# EAGLE design BUZZI-07 (EAGLE 4.15)
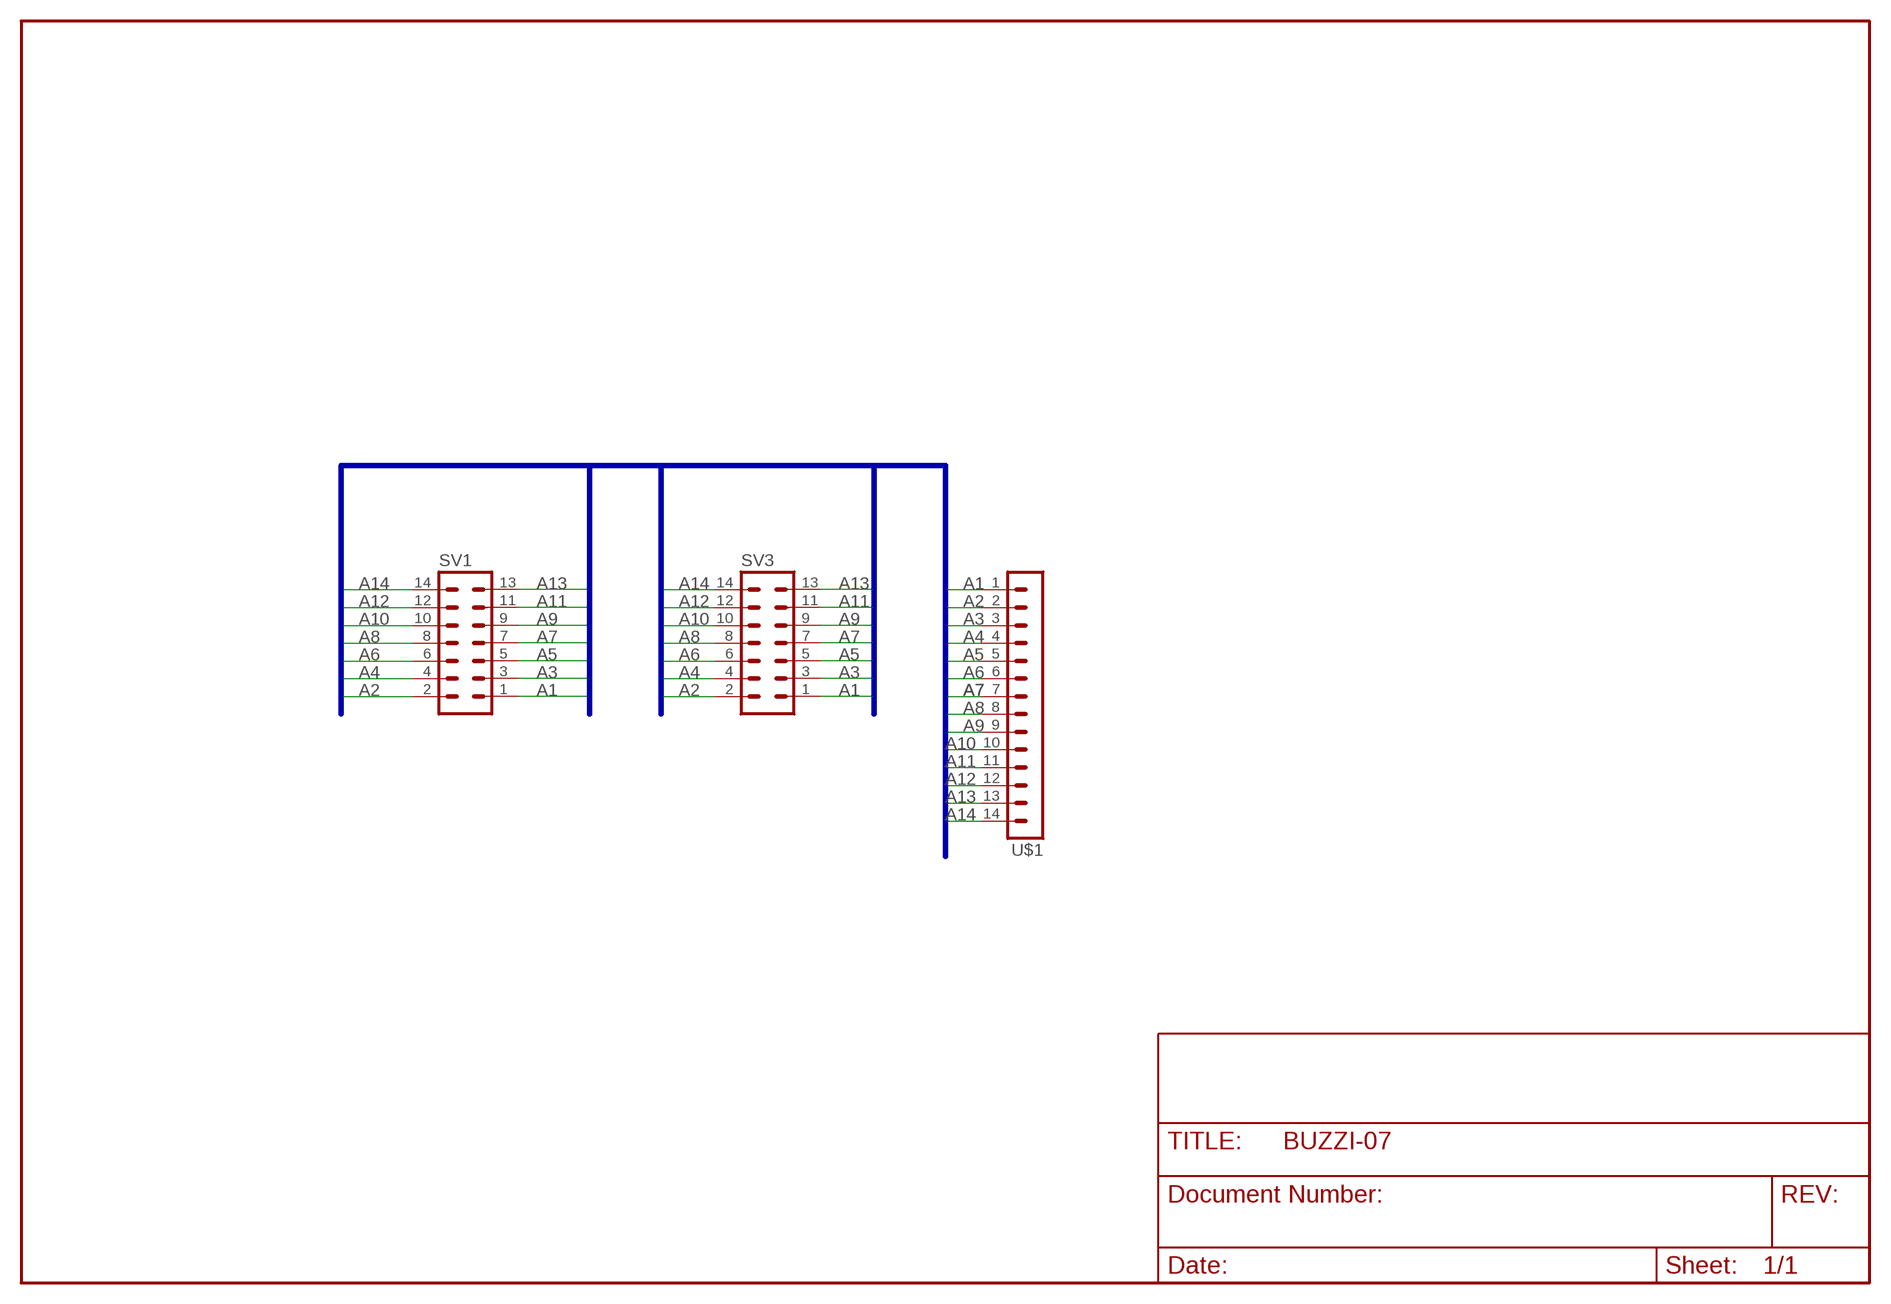
[diagram p0: schematic, sheet 1]

## Parts
SV1  ML14  [ML14]
SV3  ML14  [ML14]
U$1  MA14-1  [MA14-1]

## Nets
A1: SV1.1 SV3.1 U$1.1
A2: SV1.2 SV3.2 U$1.2
A3: SV1.3 SV3.3 U$1.3
A4: SV1.4 SV3.4 U$1.4
A5: SV1.5 SV3.5 U$1.5
A6: SV1.6 SV3.6 U$1.6
A7: SV1.7 SV3.7 U$1.7
A8: SV1.8 SV3.8 U$1.8
A9: SV1.9 SV3.9 U$1.9
A10: SV1.10 SV3.10 U$1.10
A11: SV1.11 SV3.11 U$1.11
A12: SV1.12 SV3.12 U$1.12
A13: SV1.13 SV3.13 U$1.13
A14: SV1.14 SV3.14 U$1.14

## Buses
A[1..14]

## Library data of the parts
SV1 SV3 = con-harting-ml:ML14: HARTING
U$1 = con-lstb:MA14-1

## Net classes
0 default: width 0.5 mm

## Board
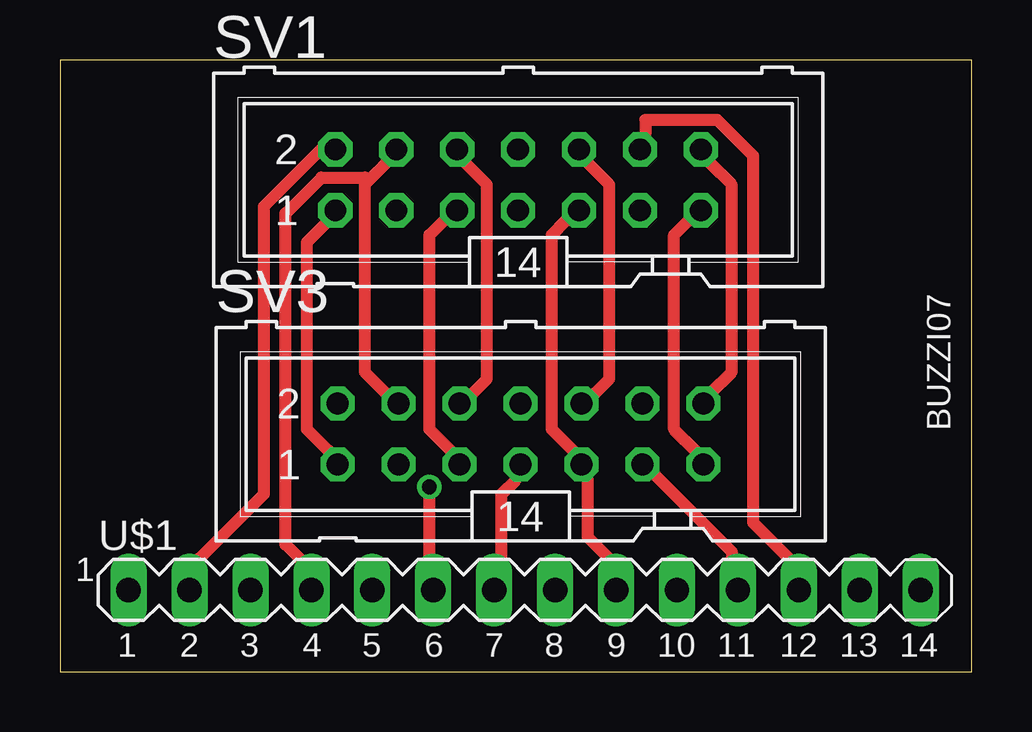
[diagram p1: board, top side]
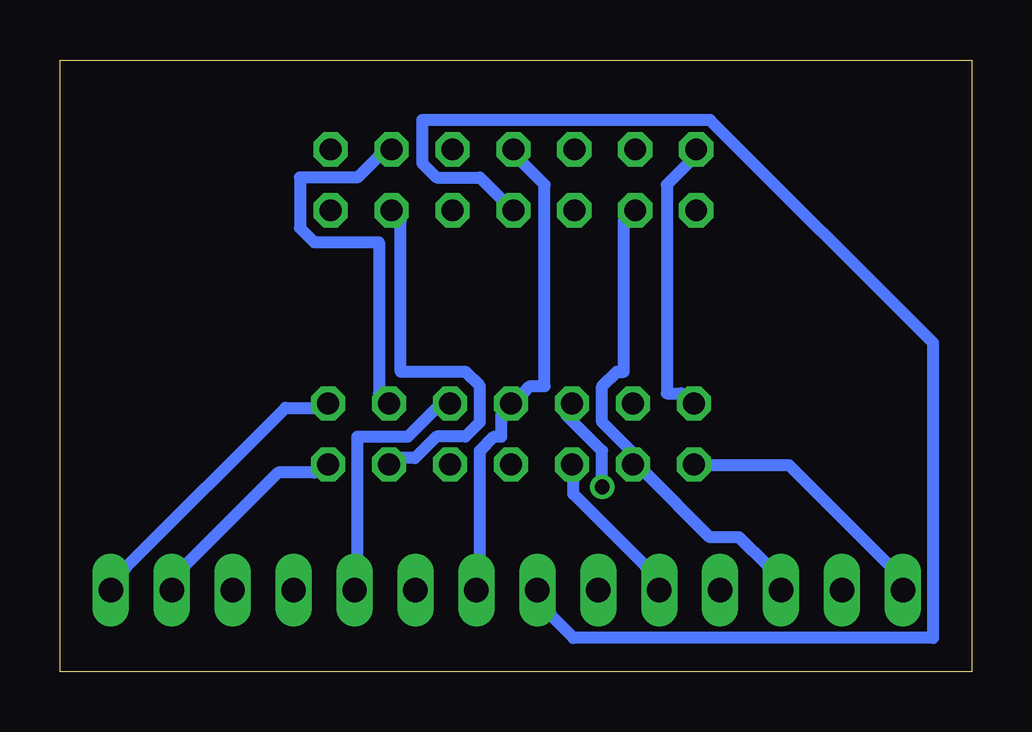
[diagram p2: board, bottom side, seen from below]

Size 38 x 25.5 mm. Coordinates in mm from the lower left corner, seen from the top.
Outline: 0,0 38,0 38,25.5 0,25.5 0,0
Copper layers (1*16): Top 0.035mm / dielectric 1.5mm / Bottom 0.035mm
Design rules "default": minimum track width 10mil, minimum drill 24mil, track to track 8mil, track to pad 8mil, pad to pad 8mil, via to via 8mil, smd to smd 8mil, copper to edge 40mil, drill to drill 8mil, minimum pad ring 10mil, minimum via ring 8mil, stop-mask expansion 4mil, vias tented up to drill 0mil, thermal gap 10mil

### Footprints (pad centres in the part's own frame; a part is rotated, then mirrored left to right if it is on the bottom)
ML14 = drill 0.914 octagon: 1 -7.62,-1.27; 2 -7.62,1.27; 3 -5.08,-1.27; 4 -5.08,1.27; 5 -2.54,-1.27; 6 -2.54,1.27; 7 0,-1.27; 8 0,1.27; 9 2.54,-1.27; 10 2.54,1.27; 11 5.08,-1.27; 12 5.08,1.27; 13 7.62,-1.27; 14 7.62,1.27
MA14-1 = drill 1.016 long: 1 -15.24,0; 2 -12.7,0; 3 -10.16,0; 4 -7.62,0; 5 -5.08,0; 6 -2.54,0; 7 0,0; 8 2.54,0; 9 5.08,0; 10 7.62,0; 11 10.16,0; 12 12.7,0; 13 15.24,0; 14 17.78,0

### Placement (x,y rotation side)
SV1  19.1,20.5 0 top
SV3  19.2,9.9 0 top
U$1  18.1,3.4 0 top

### Tracks (layer width: path | path; a pad name or v marks a point on that pad's centre or on a via)
A1
  Top 0.5: SV1.1 11.2,18.8 10.3,17.9 10.3,10.1 11.2,9.2 SV3.1
  Bottom 0.5: U$1.1 3.4,4.4 7.6,8.6 10.9,8.6 SV3.1
A2
  Top 0.5: U$1.2 5.8,4.7 8.5,7.4 8.5,19.4 10.9,21.8 SV1.2
  Bottom 0.5: SV1.2 11.8,21.2 12.7,20.3 12.7,11.6 12.1,11.6 SV3.2
A3
  Bottom 0.5: U$1.3 8.5,4.4 9.7,5.6 10.9,5.6 13.6,8.3 SV3.3 14.2,9.2 15.4,10.4 15.4,11.9 14.8,12.5 14.5,12.5 14.5,18.8 SV1.3
A4
  Top 0.5: 12.85,20.45 13.6,21.2 SV1.4 | 12.85,20.45 12.7,20.3 12.7,12.5 13.6,11.6 SV3.4 | U$1.4 10,4.7 9.4,5.3 9.4,19.1 10.9,20.6 12.7,20.6 12.85,20.45
A5
  Top 0.5: SV1.5 16,18.8 15.4,18.2 15.4,10.1 16.3,9.2 SV3.5
  Bottom 0.5: U$1.5 13.6,4.4 16.6,7.4 16.6,8 SV3.5
A6  (via drill 0.61)
  Top 0.5: SV1.6 16.9,21.2 17.8,20.3 17.8,12.2 17.2,11.6 SV3.6 | v15.4,7.7 15.4,4.7 U$1.6
  Bottom 0.5: v15.4,7.7 15.4,9.2 16.9,10.7 SV3.6
A7
  Top 0.5: SV3.7 19,8 18.4,7.4 18.4,4.7 U$1.7
  Bottom 0.5: SV1.7 19.6,19.7 20.5,20.6 22.3,20.6 22.9,21.2 22.9,23 10.9,23 1.6,13.7 1.6,1.4 16.6,1.4 17.5,2.3 U$1.7
A8
  Bottom 0.5: U$1.8 20.5,4.7 20.5,9.2 19.9,9.8 19.6,9.8 19.6,10.7 SV3.8 18.7,11.6 18.4,11.9 17.8,11.9 17.8,20.3 18.7,21.2 SV1.8
A9
  Top 0.5: SV1.9 21.1,18.8 20.5,18.2 20.5,10.1 21.4,9.2 SV3.9 22,8 22,5.6 22.9,4.7 U$1.9
A10
  Top 0.5: SV1.10 22,21.2 22.9,20.3 22.9,12.2 22.3,11.6 SV3.10
  Bottom 0.5: U$1.10 25.6,4.7 25.6,9.8 23.5,9.8 22.3,11 SV3.10
A11
  Top 0.5: SV3.11 24.7,8.3 28,5 28,4.7 U$1.11
  Bottom 0.5: SV1.11 23.8,18.8 23.8,12.5 21.1,12.5 20.5,11.9 20.5,10.4 21.1,9.8 22.3,9.8 23.2,8.9 23.8,8.9 SV3.11
A12
  Top 0.5: U$1.12 30.4,4.7 28.9,6.2 28.9,21.5 27.4,23 24.4,23 24.4,22.4 SV1.12
  Bottom 0.5: SV3.12 24.7,11.6 24.7,17.9 27.4,17.9 28,18.5 28,20.6 25.6,20.6 24.7,21.5 SV1.12
A13
  Top 0.5: SV1.13 26.2,18.8 25.6,18.2 25.6,10.1 26.5,9.2 SV3.13
  Bottom 0.5: U$1.13 32.8,4.4 28.9,8.3 27.4,8.3 SV3.13
A14
  Top 0.5: SV1.14 27.1,21.2 28,20.3 28,12.5 27.1,11.6 SV3.14
  Bottom 0.5: U$1.14 35.2,4.4 28.6,11 27.4,11 SV3.14

### Text on the board
tPlace: BUZZI07 | 1 | 2 | 3 | 4 | 5 | 6 | 7 | 8 | 9 | 10 | 11 | 12 | 13 | 14